# Altium schematic sheet cc1110.SchDoc
size A3
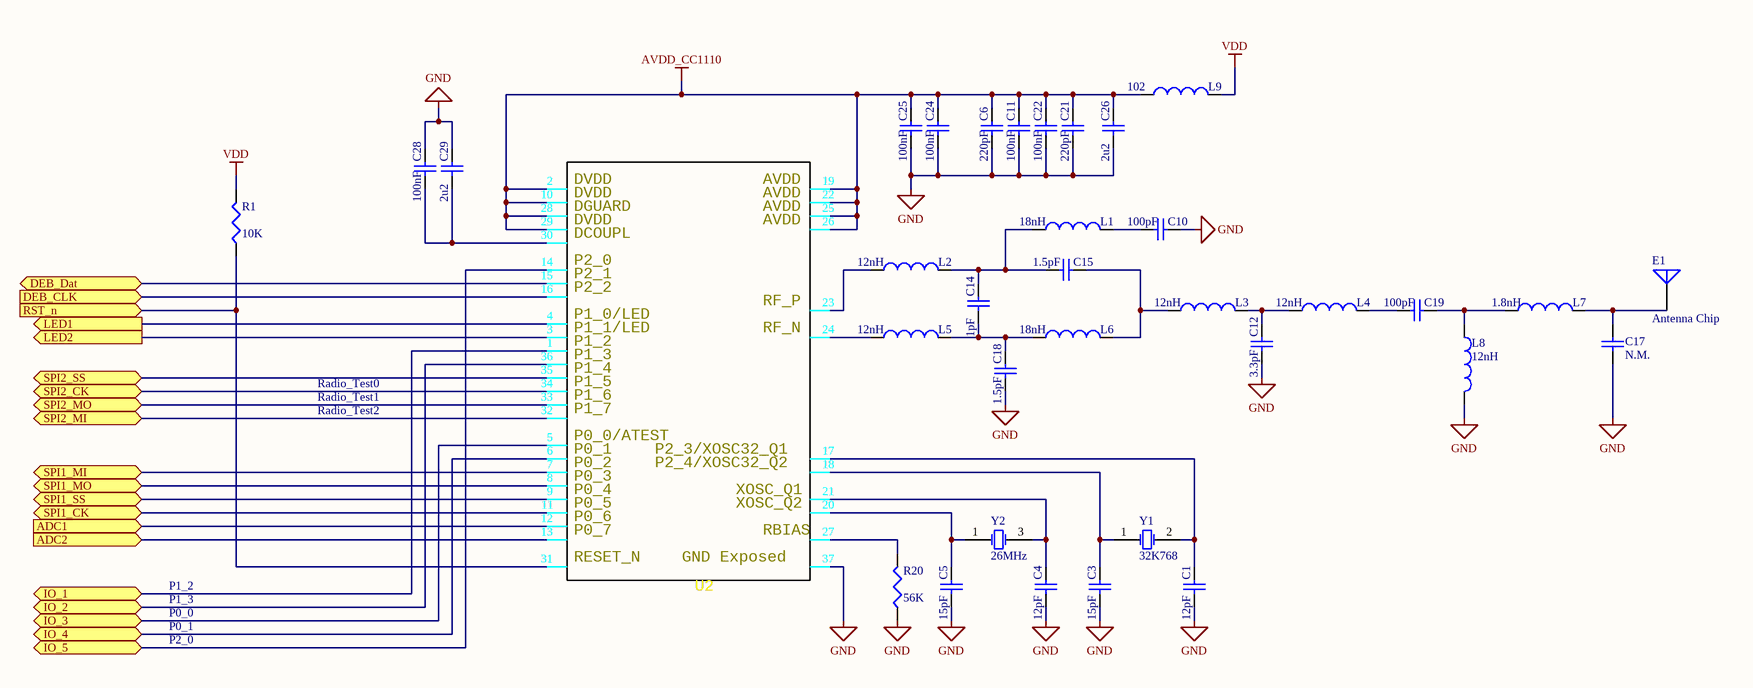
[diagram p0: cc1110.SchDoc]

## Parts
C1  value 12pF  [0402]  (hidden comment: Cap)
C3  value 15pF  [0402]  (hidden comment: Cap)
C4  value 12pF  [0402]  (hidden comment: Cap)
C5  value 15pF  [0402]  (hidden comment: Cap)
C6  value 220pF  [0402]  (hidden comment: Cap)
C10  value 100pF  [0402]  (hidden comment: Cap)
C11  value 100nF  [0402]  (hidden comment: Cap)
C12  value 3.3pF  [0402]  (hidden comment: Cap)
C14  value 1pF  [0402]  (hidden comment: Cap)
C15  value 1.5pF  [0402]  (hidden comment: Cap)
C17  value N.M.  [0402]  (hidden comment: Cap)
C18  value 1.5pF  [0402]  (hidden comment: Cap)
C19  value 100pF  [0402]  (hidden comment: Cap)
C21  value 220pF  [0402]  (hidden comment: Cap)
C22  value 100nF  [0402]  (hidden comment: Cap)
C24  value 100nF  [0402]  (hidden comment: Cap)
C25  value 100nF  [0402]  (hidden comment: Cap)
C26  value 2u2  [C0805]  (hidden comment: Cap)
C28  value 100nF  [0402]  (hidden comment: Cap)
C29  value 2u2  [C0805]  (hidden comment: Cap)
E1  Antenna Chip  [Johanson_0868AT43A0020]
L1  value 18nH  [0402-A]  (hidden comment: Inductor)
L2  value 12nH  [0402-A]  (hidden comment: Inductor)
L3  value 12nH  [0402-A]  (hidden comment: Inductor)
L4  value 12nH  [0402-A]  (hidden comment: Inductor)
L5  value 12nH  [0402-A]  (hidden comment: Inductor)
L6  value 18nH  [0402-A]  (hidden comment: Inductor)
L7  value 1.8nH  [0402-A]  (hidden comment: Inductor)
L8  value 12nH  [0402-A]  (hidden comment: Inductor)
L9  value 102  [0402-A]  (hidden comment: Inductor)
R1  value 10K  [J1-0603]  (hidden comment: Res3)
R20  value 56K  [J1-0603]  (hidden comment: Res3)
U2  CC1110  [QLP36_4_4 (Reflow)]  (value not drawn)
Y1  32K768  [xtal_3215]
Y2  26MHz  [xtal_3225]

## Ports
ADC1 (in), ADC2 (in), DEB_CLK (in), DEB_Dat (bidir), IO_1 (bidir), IO_2 (bidir), IO_3 (bidir), IO_4 (bidir), IO_5 (bidir), LED1 (out), LED2 (out), RST_n (in), SPI1_CK (bidir), SPI1_MI (bidir), SPI1_MO (bidir), SPI1_SS (bidir), SPI2_CK (bidir), SPI2_MI (bidir), SPI2_MO (bidir), SPI2_SS (bidir)

## Nets
AVDD_CC1110: C6.2 C11.2 C21.2 C22.2 C24.2 C25.2 C26.2 L9.1 U2.2 U2.10 U2.19 U2.22 U2.25 U2.26 U2.28 U2.29
GND: C1.1 C3.1 C4.1 C5.1 C6.1 C10.1 C11.1 C12.1 C17.2 C18.1 C21.1 C22.1 C24.1 C25.1 C26.1 C28.2 C29.2 L8.2 R20.1 U2.37
VDD: L9.2 R1.2
ADC1: U2.12 ; port ADC1
ADC2: U2.13 ; port ADC2
DEB_CLK: U2.16 ; port DEB_CLK
DEB_Dat: U2.15 ; port DEB_Dat
IO_1: U2.1 ; port IO_1
IO_2: U2.36 ; port IO_2
IO_3: U2.5 ; port IO_3
IO_4: U2.6 ; port IO_4
IO_5: U2.14 ; port IO_5
LED1: U2.4 ; port LED1
LED2: U2.3 ; port LED2
RST_n: R1.1 U2.31 ; port RST_n
SPI1_CK: U2.11 ; port SPI1_CK
SPI1_MI: U2.7 ; port SPI1_MI
SPI1_MO: U2.8 ; port SPI1_MO
SPI1_SS: U2.9 ; port SPI1_SS
SPI2_CK: U2.34 ; port SPI2_CK
SPI2_MI: U2.32 ; port SPI2_MI
SPI2_MO: U2.33 ; port SPI2_MO
SPI2_SS: U2.35 ; port SPI2_SS
NetC1_2: C1.2 U2.17 Y1.2(OSC2)
NetC3_2: C3.2 U2.18 Y1.1(OSC1)
NetC4_2: C4.2 U2.21 Y2.3(OSC2)
NetC5_2: C5.2 U2.20 Y2.1(OSC1)
NetC10_2: C10.2 L1.2
NetC12_2: C12.2 L3.2 L4.1
NetC14_1: C14.1 C18.2 L5.2 L6.1
NetC14_2: C14.2 C15.2 L1.1 L2.2
NetC15_1: C15.1 L3.1 L6.2
NetC17_1: C17.1 E1.1(A) L7.2
NetC19_1: C19.1 L7.1 L8.1
NetC19_2: C19.2 L4.2
NetC28_1: C28.1 C29.1 U2.30
NetL2_1: L2.1 U2.23
NetL5_1: L5.1 U2.24
NetR20_2: R20.2 U2.27

## Notes on the sheet
- Radio_Test0
- Radio_Test1
- Radio_Test2
- P1_2
- P1_3
- P0_0
- P0_1
- P2_0
- (in symbol CC1110) DVDD; AVDD; DGUARD; DCOUPL; P2_0; P2_1; P2_2; RF_P; P1_0/LED; P1_1/LED; RF_N; P1_2; P1_3; P1_4; P1_5; P1_6; P1_7; P0_0/ATEST; P0_1; P2_3/XOSC32_Q1; P0_2; P2_4/XOSC32_Q2; P0_3; P0_4; XOSC_Q1; P0_5; XOSC_Q2; P0_6; P0_7; RBIAS; RESET_N; GND Exposed

## Library data of the parts
C1 C4 = Cap: Capacitor; Manufacturer: FARNELL; RS: 788-0263; Order N: 2210762; Published: 8-Jun-2000; LatestRevisionDate: 17-Jul-2002; LatestRevisionNote: Re-released for DXP Platform.; PackageReference: RAD-0.3; Publisher: Altium Limited; PackageDescription: Radial Cap, Thru-Hole; 2 Leads; 0.3 in Pin Spacing; FARNELL: 2210762
C3 C5 = Cap: Capacitor; Manufacturer: FARNELL; RS: 788-0266; Order N: 2218840; Published: 8-Jun-2000; LatestRevisionDate: 17-Jul-2002; LatestRevisionNote: Re-released for DXP Platform.; PackageReference: RAD-0.3; Publisher: Altium Limited; PackageDescription: Radial Cap, Thru-Hole; 2 Leads; 0.3 in Pin Spacing; FARNELL: 2218840
C6 C21 = Cap: Capacitor; Manufacturer: FARNELL; RS: 624-2941; Order N: 2426879; Published: 8-Jun-2000; LatestRevisionDate: 17-Jul-2002; LatestRevisionNote: Re-released for DXP Platform.; PackageReference: RAD-0.3; Publisher: Altium Limited; PackageDescription: Radial Cap, Thru-Hole; 2 Leads; 0.3 in Pin Spacing; FARNELL: 2426879
C10 C19 = Cap: Capacitor; Manufacturer: FARNELL; RS: 806-8495; Order N: 2426878; Published: 8-Jun-2000; LatestRevisionDate: 17-Jul-2002; LatestRevisionNote: Re-released for DXP Platform.; PackageReference: RAD-0.3; Publisher: Altium Limited; PackageDescription: Radial Cap, Thru-Hole; 2 Leads; 0.3 in Pin Spacing; FARNELL: 2426878
C11 C22 C24 C25 C28 = Cap: Capacitor; Manufacturer: FARNELL; RS: 788-2843; Order N: 2309011; Published: 8-Jun-2000; LatestRevisionDate: 17-Jul-2002; LatestRevisionNote: Re-released for DXP Platform.; PackageReference: RAD-0.3; Publisher: Altium Limited; PackageDescription: Radial Cap, Thru-Hole; 2 Leads; 0.3 in Pin Spacing; FARNELL: 2309011
C12 = Cap: Capacitor; Manufacturer: FARNELL; RS: 751-2049; Order N: 2210780; Published: 8-Jun-2000; LatestRevisionDate: 17-Jul-2002; LatestRevisionNote: Re-released for DXP Platform.; PackageReference: RAD-0.3; Publisher: Altium Limited; PackageDescription: Radial Cap, Thru-Hole; 2 Leads; 0.3 in Pin Spacing; FARNELL: 2210780
C14 = Cap: Capacitor; Manufacturer: FARNELL; RS: 788-0279; Order N: 1611944; Published: 8-Jun-2000; LatestRevisionDate: 17-Jul-2002; LatestRevisionNote: Re-released for DXP Platform.; PackageReference: RAD-0.3; Publisher: Altium Limited; PackageDescription: Radial Cap, Thru-Hole; 2 Leads; 0.3 in Pin Spacing; FARNELL: 1611944
C15 C18 = Cap: Capacitor; Manufacturer: FARNELL; RS: 788-0276; Order N: 1828869; Published: 8-Jun-2000; LatestRevisionDate: 17-Jul-2002; LatestRevisionNote: Re-released for DXP Platform.; PackageReference: RAD-0.3; Publisher: Altium Limited; PackageDescription: Radial Cap, Thru-Hole; 2 Leads; 0.3 in Pin Spacing; FARNELL: 1828869
C17 = Cap: Capacitor; Published: 8-Jun-2000; LatestRevisionDate: 17-Jul-2002; LatestRevisionNote: Re-released for DXP Platform.; PackageReference: RAD-0.3; Publisher: Altium Limited; PackageDescription: Radial Cap, Thru-Hole; 2 Leads; 0.3 in Pin Spacing
C26 C29 = Cap: Capacitor; Manufacturer: FARNELL; RS: 749-2138; Order N: 1759416; Published: 8-Jun-2000; LatestRevisionDate: 17-Jul-2002; LatestRevisionNote: Re-released for DXP Platform.; PackageReference: RAD-0.3; Publisher: Altium Limited; PackageDescription: Radial Cap, Thru-Hole; 2 Leads; 0.3 in Pin Spacing; FARNELL: 1759416
E1 = Antenna: Generic Antenna; Manufacturer: FARNELL; RS: N.E.; PN: 0868AT43A0020E; Order N: 1885493; Published: 24-Mar-1999; LatestRevisionDate: 17-Jul-2002; LatestRevisionNote: Re-released for DXP Platform.; PackageReference: PIN1; Publisher: Altium Limited; FARNELL: 1885493
L1 L6 = Inductor: Manufacturer: FARNELL; Code_IEC: 1005; RS: 777-7022; Order N: 2103101; Published: 8-Jun-2000; LatestRevisionDate: 29-May-2009; LatestRevisionNote: IPC-7351 Footprint Added.; PackageReference: 0402-A; Publisher: Altium Limited; PackageDescription: Chip Inductor; Code_JEITA: 0402; FARNELL: 2103101
L2-L5 L8 = Inductor: Manufacturer: FARNELL; Code_IEC: 1005; RS: 701-6910; Order N: 2103098; Published: 8-Jun-2000; LatestRevisionDate: 29-May-2009; LatestRevisionNote: IPC-7351 Footprint Added.; PackageReference: 0402-A; Publisher: Altium Limited; PackageDescription: Chip Inductor; Code_JEITA: 0402; FARNELL: 2103098
L7 = Inductor: Manufacturer: FARNELL; Code_IEC: 1005; RS: 701-6807; Order N: 1669627; Published: 8-Jun-2000; LatestRevisionDate: 29-May-2009; LatestRevisionNote: IPC-7351 Footprint Added.; PackageReference: 0402-A; Publisher: Altium Limited; PackageDescription: Chip Inductor; Code_JEITA: 0402; FARNELL: 1669627
L9 = Inductor: Manufacturer: FARNELL; Code_IEC: 1005; RS: 777-6861; Order N: 1669624; Published: 8-Jun-2000; LatestRevisionDate: 29-May-2009; LatestRevisionNote: IPC-7351 Footprint Added.; PackageReference: 0402-A; Publisher: Altium Limited; PackageDescription: Chip Inductor; Code_JEITA: 0402; FARNELL: 1669624
R1 = Res3: Resistor; Manufacturer: FARNELL; RS: N.E.; Order N: 2333520; Published: 8-Jun-2000; LatestRevisionDate: 29-May-2009; LatestRevisionNote: IPC-7351 Footprint Added.; PackageReference: J1-0603; Publisher: Altium Limited; PackageDescription: Chip Resistor; FARNELL: 2333520
R20 = Res3: Resistor; Manufacturer: FARNELL; RS: N.E.; Order N: 2331750; Published: 8-Jun-2000; LatestRevisionDate: 29-May-2009; LatestRevisionNote: IPC-7351 Footprint Added.; PackageReference: J1-0603; Publisher: Altium Limited; PackageDescription: Chip Resistor; FARNELL: 2331750
U2 = CC1110: Single chip transceiver; Manufacturer: FARNELL; RS: 459-342; PN: CC1110F32RHHR; Order N: 2422916; FARNELL: 2422916
Y1 = XTAL: Crystal Oscillator; Manufacturer: Smart Prototyping; SP: SP-C14473; Value: 32.768KHz; FARNELL: 2449398; Order N: SP-C14473
Y2 = XTAL_4: Crystal Oscillator; Manufacturer: Smart Prototyping; SP: SP-C23363; RS: *; FARNELL: 2101340; Value: 26MHz; Order N: SP-C23363